# EAGLE design tvbgone3 (EAGLE 5.10)
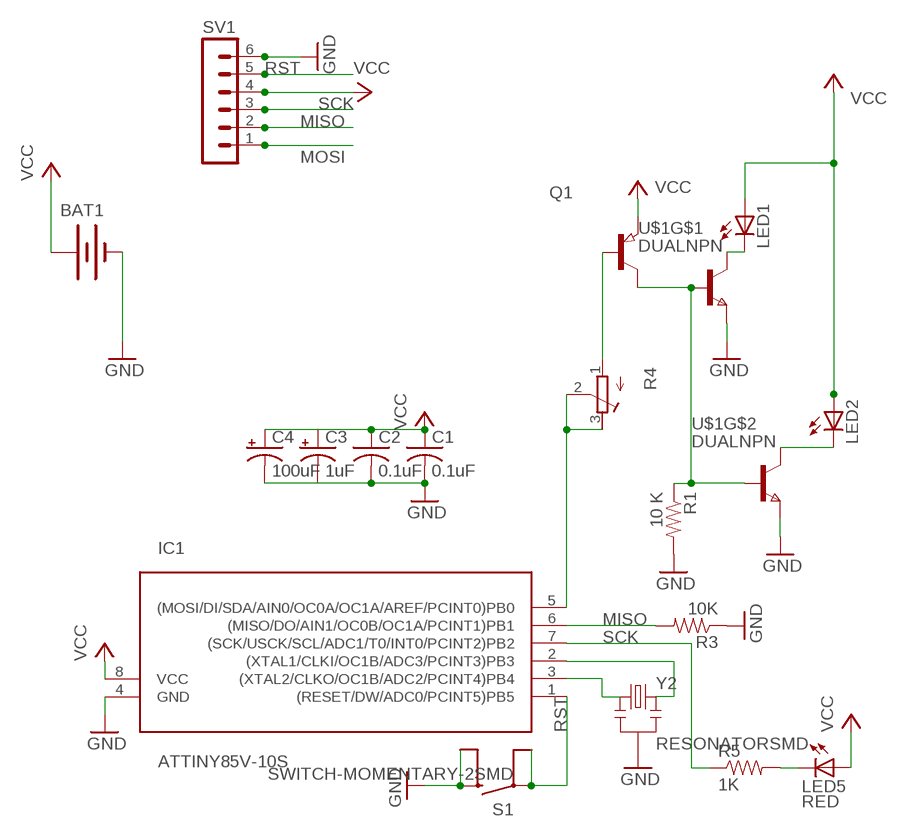
[diagram p0: schematic, sheet 1]

## Parts
BAT1  BATTERY245MM  [BATTCON_245MM]
C1  0.1uF  C-USC0805K  [C0805K]
C2  0.1uF  C-USC0805K  [C0805K]
C3  1uF  CAP_POL1206  [EIA3216]
C4  100uF  CAP_POL7343  [EIA7343]
IC1  ATTINY85V-10S  [SOIC8]
LED1  LEDSIDELED  [OSRAM-SIDELED]
LED2  LEDSIDELED  [OSRAM-SIDELED]
LED5  RED  LEDCHIPLED_1206  [CHIPLED_1206]
Q1  PNP-TRANSISTOR_SOT23  [SOT23]
R1  10 K  RESISTOR  [0805]
R3  10K  RESISTOR  [0805]
R4  R-TRIMM3103  [RTRIM3103]
R5  1K  RESISTOR  [0805]
S1  SWITCH-MOMENTARY-2SMD  [TACTILE_SWITCH_SMD]
SV1  CON-LSTB_MA06-1  [CON-LSTB_MA06-1]
U$1  DUALNPN  [SSOT6]
Y2  RESONATORSMD  [RESONATOR-SMD]

## Nets
GND: BAT1.2(-) C1.2 C2.2 C3.C(-) C4.C(-) IC1.4(GND) R1.2 R3.1 S1.3 S1.4 SV1.6 U$1.2(E) U$1.5(E) Y2.2
MISO: IC1.6((MISO/DO/AIN1/OC0B/OC1A/PCINT1)PB1) R3.2 SV1.2
MOSI: IC1.5((MOSI/DI/SDA/AIN0/OC0A/OC1A/AREF/PCINT0)PB0) R4.2(S) R4.3(A) SV1.1
N$1: IC1.3((XTAL2/CLKO/OC1B/ADC2/PCINT4)PB4) Y2.1
N$2: IC1.2((XTAL1/CLKI/OC1B/ADC3/PCINT3)PB3) Y2.3
N$3: LED5.C R5.2
N$4: Q1.3(C) R1.1 U$1.1(B) U$1.3(B)
N$6: Q1.1(B) R4.1(E)
N$8: LED2.C U$1.4(C)
N$11: LED1.C U$1.6(C)
RST: IC1.1((RESET/DW/ADC0/PCINT5)PB5) S1.1 S1.2 SV1.5
SCK: IC1.7((SCK/USCK/SCL/ADC1/T0/INT0/PCINT2)PB2) R5.1 SV1.3
VCC: BAT1.1(+) C1.1 C2.1 C3.A(+) C4.A(+) IC1.8(VCC) LED1.A LED2.A LED5.A Q1.2(E) SV1.4

## Library data of the parts
BAT1 = SparkFun:BATTERY: Battery Holders Various common sizes : AA, AAA, 20mm coin cell and 12mm coin cell.
C1 C2 = rcl-ez:C-US: CAPACITOR, American symbol
C3 C4 = SparkFun:CAP_POL: Capacitor Polarized These are standard SMD and PTH capacitors. Normally 10uF, 47uF, and 100uF in electrolytic and tantalum varieties. Always verify the external diameter of the through hole cap, it varies with capacity, voltage, and manufacturer. The EIA devices should be standard.
IC1 = avr:ATTINY85: MICROCONTROLLER 8 Kbytes FLASH 512 bytes EEPROM 512 bytes RAM 4-channel 10 bit ADC USI
LED1 LED2 = led:LED: LED
LED5 = minimidi:LED: LED
Q1 = semicon-smd-ipc:PNP-TRANSISTOR_: PNP TRANSISTOR
R1 R3 R5 = SparkFun:RESISTOR: Resistor Basic schematic elements and footprints for 0603, 1206, and PTH 1/10th watt (small) resistors.
R4 = resistor:R-TRIMM: Trimm resistor
S1 = SparkFun:SWITCH-MOMENTARY-2
SV1 = NSL:CON-LSTB_MA06-1: PIN HEADER
U$1 = fairchild-semic:DUALNPN
Y2 = SparkFun:RESONATOR: Resonator Small SMD resonator. This is the itty bitty 10/20MHz resonators with built in caps. CSTCE10M0G55 and CSTCE20M0V53. Footprint has been reviewed closely but hasn't been tested yet.

## Board
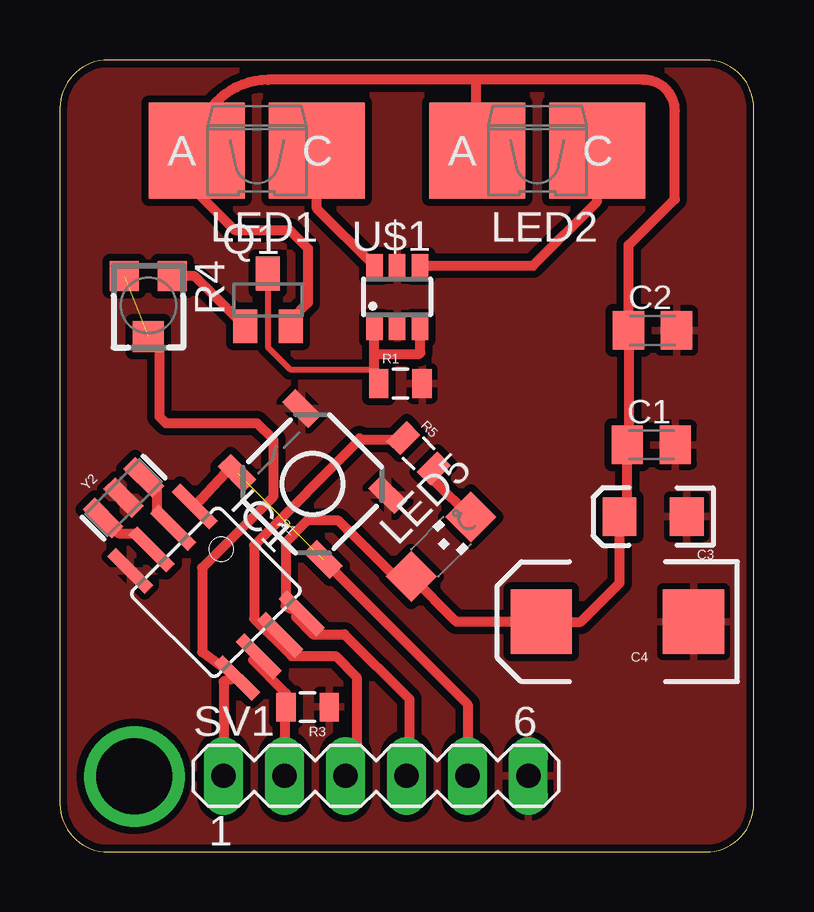
[diagram p1: board, top side]
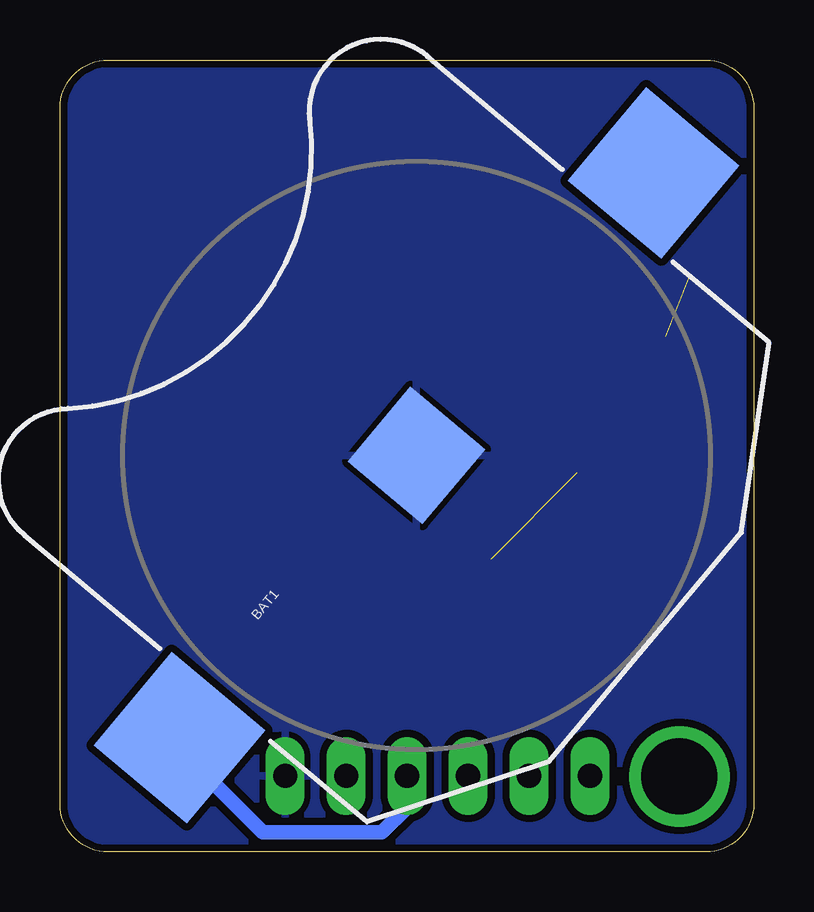
[diagram p2: board, bottom side, seen from below]

Size 28.91 x 33.02 mm. Coordinates in mm from the lower left corner, seen from the top.
Outline: 28.91,31.02 arc90 26.91,33.02 2,33.02 arc90 0,31.02 0,2 arc90 2,0 26.91,0 arc90 28.91,2 28.91,31.02
Copper layers (1*16): Top 0.0356mm / dielectric 1.5011mm / Bottom 0.0356mm
Design rules "SparkFun-mod": minimum track width 8mil, minimum drill 20mil, track to track 12mil, track to pad 12mil, pad to pad 8mil, via to via 8mil, smd to smd 8mil, copper to edge 12mil, drill to drill 8mil, minimum pad ring 12mil, minimum via ring 10mil, stop-mask expansion 4mil, vias tented up to drill 25mil, thermal gap 10mil

### Footprints (pad centres in the part's own frame; a part is rotated, then mirrored left to right if it is on the bottom)
BATTCON_245MM = smd 5.08 x 5.08: 1 -15.367,0; 3 15.367,0 | smd 4.064 x 4.064: 2 0,0
C0805K = smd 1.3 x 1.6: 1 -1,0; 2 1,0
EIA3216 = smd 1.4 x 1.6: A 1.4,0; C -1.4,0
EIA7343 = smd 2.55 x 2.7: A 3.17,0; C -3.17,0
SOIC8 = smd 0.5 x 2.2: 1 -1.905,-3.154; 2 -0.645,-3.154; 3 0.625,-3.154; 4 1.895,-3.154; 5 1.905,3.154; 6 0.635,3.154; 7 -0.635,3.154; 8 -1.905,3.154
OSRAM-SIDELED = smd 4 x 4: A 0,2.5; C 0,-2.5
CHIPLED_1206 = smd 1.5 x 1.5: A 0,-1.75; C 0,1.75
SOT23 = smd 1 x 1.4: 1 -0.95,-1.1; 2 0.95,-1.1; 3 0,1.1
0805 = smd 0.8 x 1.2: 1 -0.9,0; 2 0.9,0
RTRIM3103 = smd 1.2 x 1.25: 1 -1,-1.225; 3 1,-1.225 | smd 1.3 x 1.3: 2 0,1.3
TACTILE_SWITCH_SMD = smd 1.524 x 0.762: 1 -2.54,1.905; 2 2.54,1.905; 3 -2.54,-1.905; 4 2.54,-1.905
CON-LSTB_MA06-1 = drill 1.016 long: 1 -6.35,0; 2 -3.81,0; 3 -1.27,0; 4 1.27,0; 5 3.81,0; 6 6.35,0
SSOT6 = smd 0.69 x 0.99: 1 -0.95,-1.3; 2 0,-1.3; 3 0.95,-1.3; 4 0.95,1.3; 5 0,1.3; 6 -0.95,1.3
RESONATOR-SMD = smd 0.7 x 1.7: 1 -1.2,0; 2 0,0; 3 1.2,0

### Placement (x,y rotation side)
BAT1  14.05,16.54 50 bottom
C1  24.64,16.98 0 top
C2  24.69,21.74 0 top
C3  24.71,13.98 180 top
C4  23.23,9.6 180 top
IC1  6.5,10.83 225 top
LED1  8.2,29.24 90 top
LED2  19.89,29.24 90 top
LED5  15.87,12.72 315 top
Q1  8.66,23.01 0 top
R1  14.19,19.53 0 top
R3  10.32,6.04 180 top
R4  3.68,22.78 180 top
R5  14.95,16.62 315 top
S1  10.52,15.34 135 top
SV1  13.17,3.17 0 top
U$1  14.05,23.14 0 top
Y2  2.65,14.77 45 top

### Tracks (layer width: path | path; a pad name or v marks a point on that pad's centre or on a via)
GND
  pour Top: -1.63,34.34 30.07,34.34 30.07,-2.84 -1.63,-2.84
  pour Bottom: -0.41,33.53 29.46,33.53 29.46,-1.42 -0.41,-1.42
MISO
  Top 0.406: IC1.6 8.04,8 9.42,6.62 R3.2 9.36,5.99 SV1.2
MOSI  (1 unrouted)
  Top 0.406: SV1.1 6.82,7.11 IC1.5 5.92,8.33 5.92,11.85 8.88,14.81 8.88,17.21 8.2,17.88 4.41,17.88 4.14,18.15 4.14,21.03 R4.2
N$1
  Top 0.406: IC1.3 3.15,13.28 2.44,13.28 Y2.1
N$2
  Top 0.406: IC1.2 4.7,13.52 4.03,14.19 4.03,15.09 Y2.3
N$3
  Top 0.406: R5.2 15.58,15.49 LED5.C
N$4
  Top 0.254: 8.64,24.09 Q1.3 8.66,21.04 9.59,20.12 13.05,20.12 13.1,20.07 13.1,19.72 R1.1 | U$1.3 15.01,21.84
  Top 0.406: 13.1,20.07 13.1,20.76 | 13.1,20.76 U$1.1 | 13.1,20.76 14.97,20.76 15.01,20.8 15.01,21.82 U$1.3
N$5  (via drill 3.17)
  other vias: 3.1,3.15
N$6
  Top 0.406: R4.1 5.62,24.01 Q1.1
N$8
  Top 0.406: U$1.4 19.7,24.44 22.38,27.11 LED2.C
N$11
  Top 0.406: U$1.6 10.7,26.83 LED1.C
RST  (1 unrouted)
  Top 0.406: S1.2 6.9,15.79 IC1.1 | S1.1 11.42,11.75 11.42,11.71 16.98,6.15 SV1.5
SCK
  Top 0.406: IC1.7 9.67,8.18 9.67,8.17 | 9.67,8.17 11.48,8.17 12.36,7.29 12.36,3.63 SV1.3 | 9.67,8.17 9.65,8.17 8.09,9.73 8.09,12.79 12.47,17.17 | 12.47,17.17 12.47,17.26 | 12.47,17.17 14.23,17.17 R5.1
VCC
  Top 0.406: SV1.4 14.55,3.29 14.55,6.38 11.85,9.08 10.54,9.08 9.83,9.79 IC1.8 9.4,10.24 9.4,12.9 10.31,13.82 11.6,13.82 11.99,13.42 12.01,13.42 13.95,11.49 LED5.A 16.52,9.6 C4.A 21.7,9.6 23.31,11.21 C3.A 23.64,14.31 C1.1 23.72,16.98 23.72,21.71 arc90 C2.1 23.69,25.29 arc-90 23.72,25.32 25.62,27.22 25.62,30.9 arc90 24.32,32.19 17.32,32.19 | 17.32,32.19 8.66,32.19 arc90 LED1.A 5.39,28.92 5.39,27.83 7.28,25.93 9.56,25.93 10.33,25.17 10.33,22.9 9.61,22.18 Q1.2 | LED2.A arc-90 17.44,29.19 17.44,29.13 arc-90 17.32,29.25 17.32,32.19
  Bottom 0.61: BAT1.1 23.93,4.3 20.45,0.81 15.49,0.81 14.48,1.83 14.48,3.14 SV1.4